# EasyEDA schematic SCH_PicoPocket_2025-07-21.json
TITLE: PICOPOCKET; REV: 1.0; Date: 2024-08-20; Sheet: 1/1; Drawn By: Mzoid; Company: Megazoid's Hut
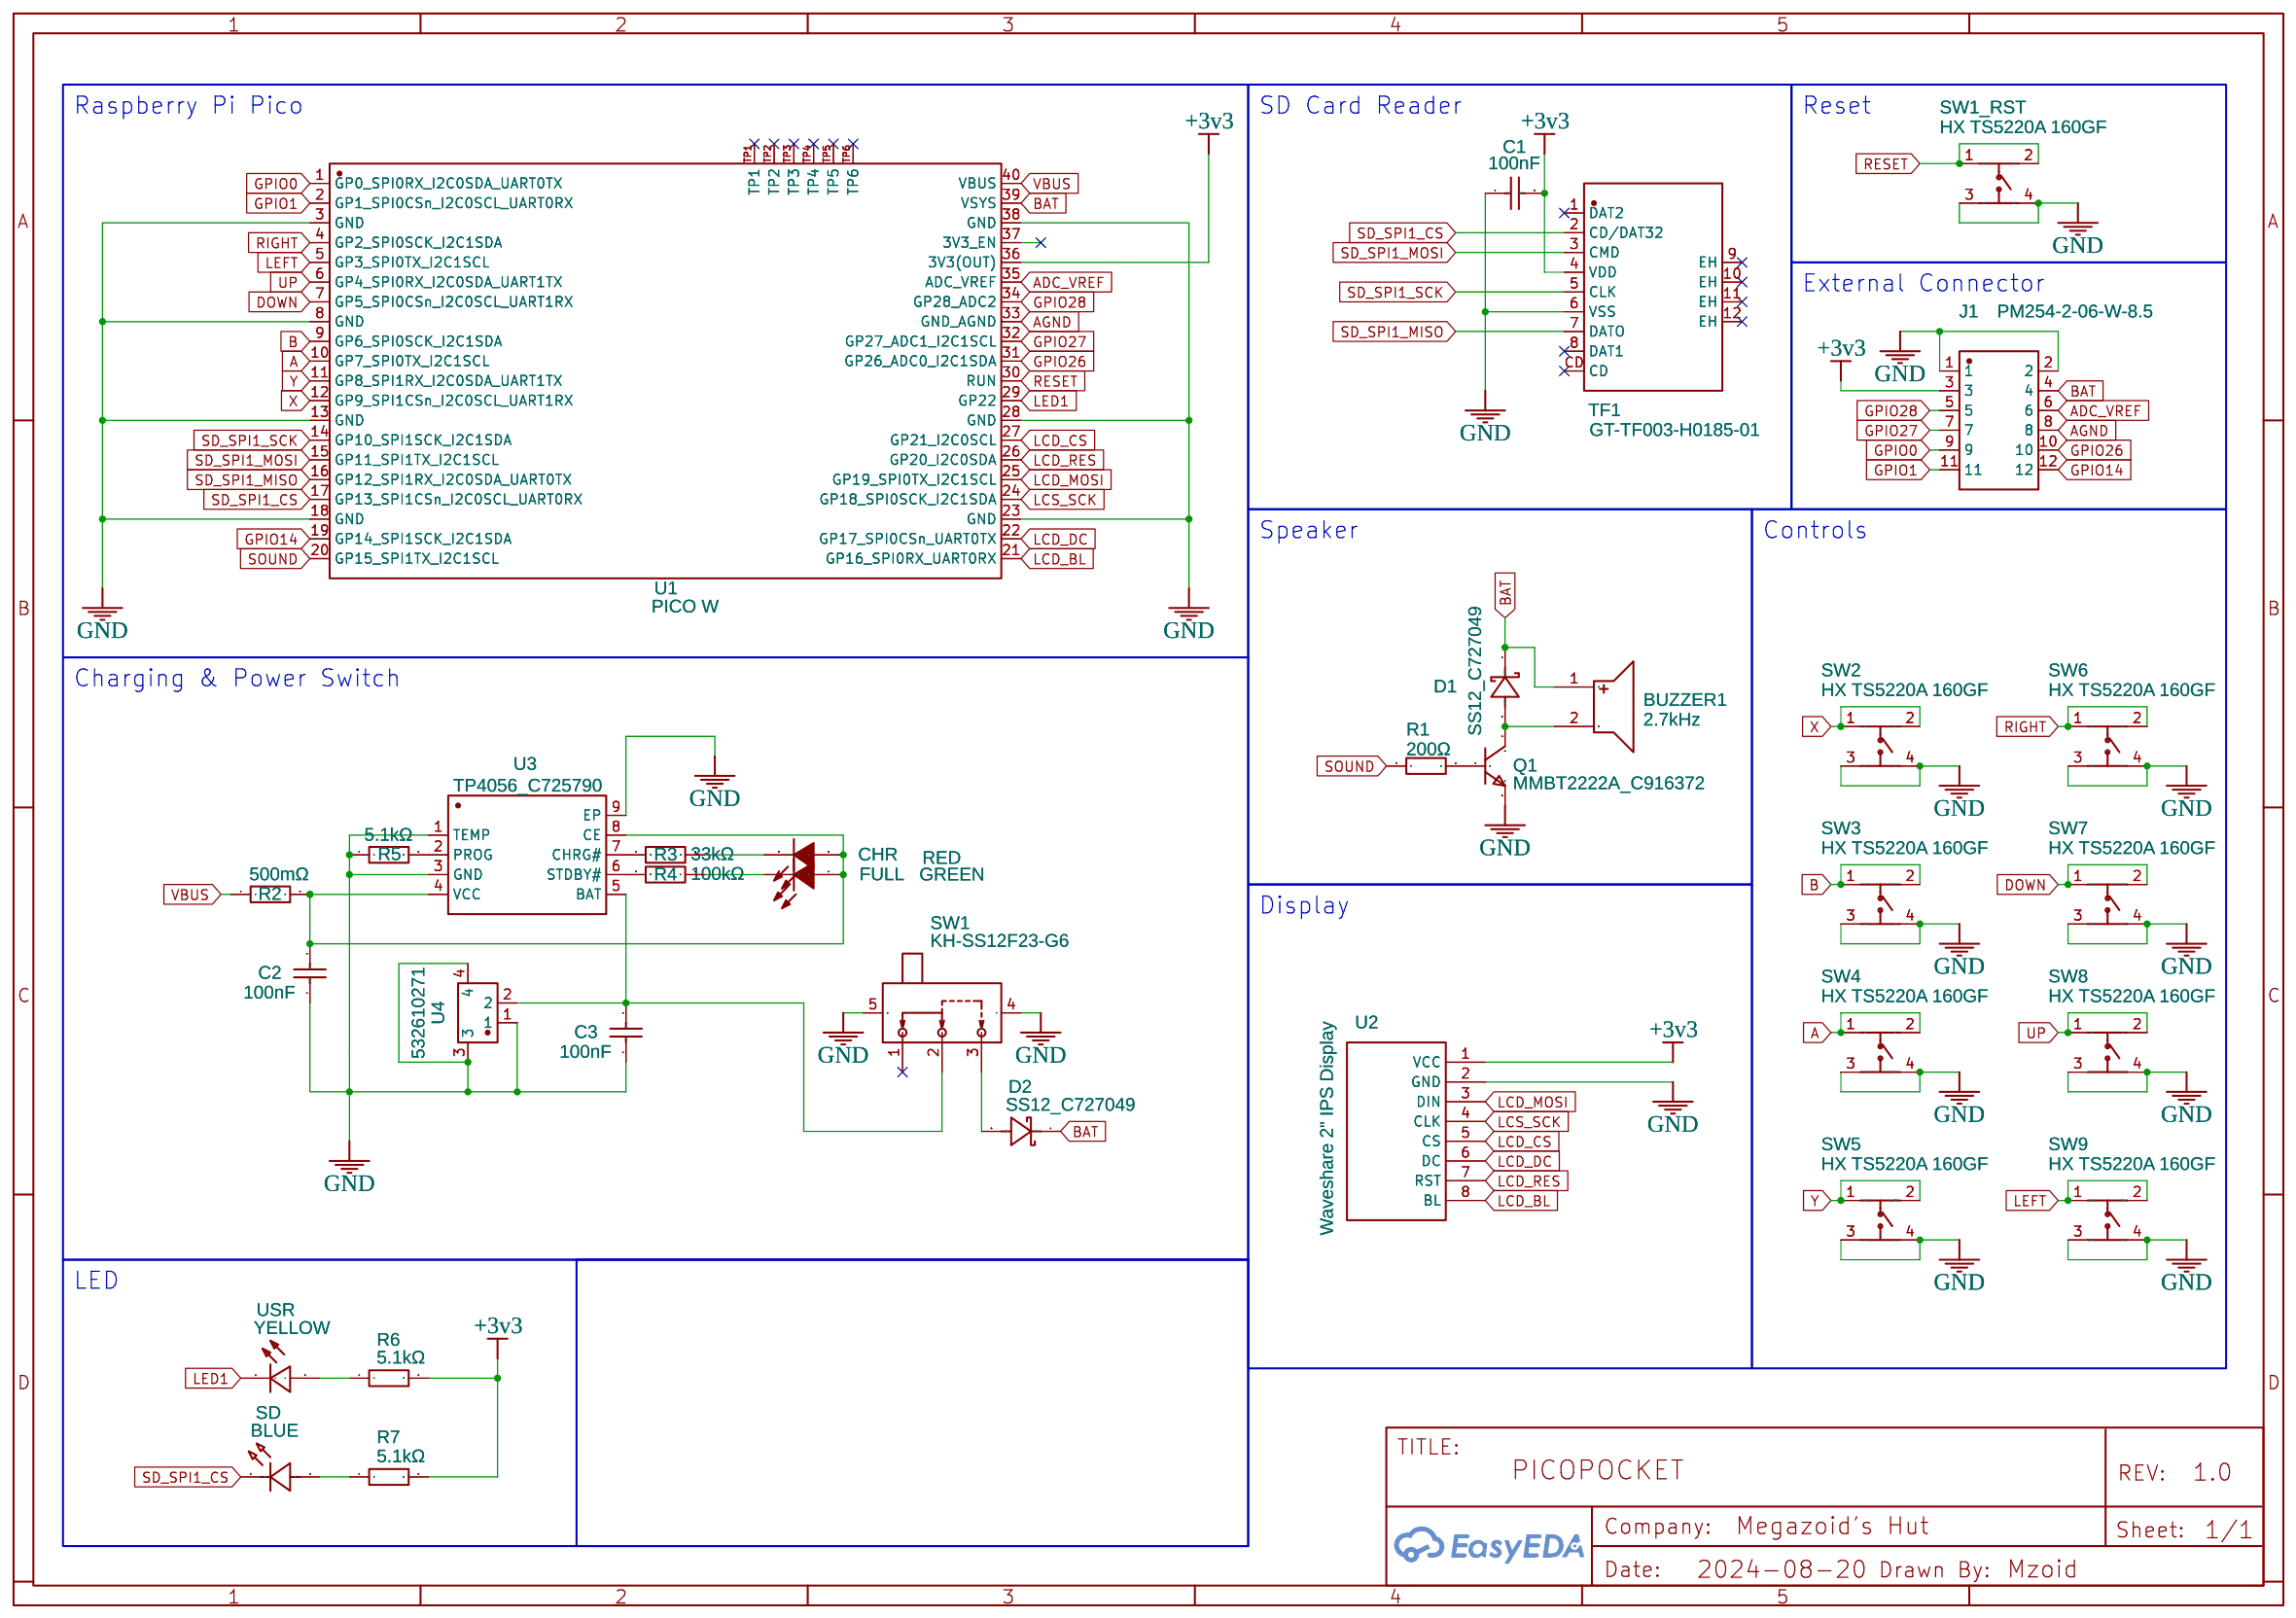
[diagram p0: schematic sheet]

## Parts
BUZZER1  2.7kHz  [BUZ-SMD_FUET-9032-XXV]
C1  100nF  [C0805]
C2  100nF  [C0805]
C3  100nF  [C0805]
CHR  RED  [LED-0603]
D1  SS12_C727049  [SMA_L4.3-W2.5-LS5.0-RD]
D2  SS12_C727049  [SMA_L4.3-W2.5-LS5.0-RD]
FULL  GREEN  [LED-0603]
J1  PM254-2-06-W-8.5  [HDR-TH_12P-P2.54-H-F-R2-C6-W8.5]
Q1  MMBT2222A_C916372  [SOT-23-3_L2.9-W1.3-P1.90-LS2.4-BR]
R1  200Ω  [R0805]
R2  500mΩ  [R0805]
R3  33kΩ  [R0603]
R4  100kΩ  [R0603]
R5  5.1kΩ  [R0603]
R6  5.1kΩ  [R0603]
R7  5.1kΩ  [R0603]
SD  BLUE  [LED0603-RD COPY]
SW1  KH-SS12F23-G6  [SW-TH_KH-SS12F23-G6]
SW1_RST  HX TS5220A 160GF  [SW-SMD_4P-L5.2-W5.2-P3.70-LS6.4]
SW2  HX TS5220A 160GF  [SW-SMD_4P-L5.2-W5.2-P3.70-LS6.4]
SW3  HX TS5220A 160GF  [SW-SMD_4P-L5.2-W5.2-P3.70-LS6.4]
SW4  HX TS5220A 160GF  [SW-SMD_4P-L5.2-W5.2-P3.70-LS6.4]
SW5  HX TS5220A 160GF  [SW-SMD_4P-L5.2-W5.2-P3.70-LS6.4]
SW6  HX TS5220A 160GF  [SW-SMD_4P-L5.2-W5.2-P3.70-LS6.4]
SW7  HX TS5220A 160GF  [SW-SMD_4P-L5.2-W5.2-P3.70-LS6.4]
SW8  HX TS5220A 160GF  [SW-SMD_4P-L5.2-W5.2-P3.70-LS6.4]
SW9  HX TS5220A 160GF  [SW-SMD_4P-L5.2-W5.2-P3.70-LS6.4]
TF1  GT-TF003-H0185-01  [TF-SMD_GT-TF003-H0185-01]
U1  PICO W  [COMM-SMD_L51.0-W21.0-P2.54_PICOW]
U2  Waveshare 2" IPS Display  [2INCH IPS LCD MODULE WAVESHARE NO HOLE]
U3  TP4056_C725790  [ESOP-8_L4.9-W3.9-P1.27-LS6.0-BL-EP]
U4  532610271  [CONN-SMD_532610271]
USR  YELLOW  [LED0603-RD COPY]

## Library data of the parts
BUZZER1 = FUET-9032-05: Contributor: LCSC; Supplier: LCSC; Supplier Part: C2690510; Manufacturer: FUET(福声科技); JLCPCB Part Class: Extended Part
C1-C3 = CC0805KRX7R9BB104: Supplier: LCSC; Manufacturer: YAGEO(国巨); Supplier Part: C49678; JLCPCB Part Class: Basic Part
CHR = -: Supplier: LCSC; Manufacturer: LITEON; Manufacturer Part: LTST-C191KRKT; Contributor: LCSC; Supplier Part: C125099
D1 D2 = SS12_C727049: Contributor: LCSC; Supplier: LCSC; Supplier Part: C727049; Manufacturer: TWGMC(台湾迪嘉); Manufacturer Part: SS12; JLCPCB Part Class: Extended Part
FULL = -: Supplier: LCSC; Manufacturer: LITEON; Manufacturer Part: LTST-C193TGKT-5A; Supplier Part: C12065
J1 = PM254-2-06-W-8.5: Contributor: LCSC; Supplier: LCSC; Supplier Part: C2897426; Manufacturer: HCTL(华灿天禄); JLCPCB Part Class: Extended Part
Q1 = MMBT2222A_C916372: Contributor: LCSC; Supplier: LCSC; Supplier Part: C916372; Manufacturer: JSMSEMI(杰盛微); Manufacturer Part: MMBT2222A; JLCPCB Part Class: Extended Part
R1 = 0805W8F2000T5E: Supplier: LCSC; Manufacturer: UNI-ROYAL(厚声); Supplier Part: C17540; JLCPCB Part Class: Basic Part
R2 = 0805W8F500LT5E: Supplier: LCSC; Manufacturer: UNI-ROYAL(厚声); Supplier Part: C28319; JLCPCB Part Class: Extended Part
R3 = 0603WAF1201T5E: Supplier: LCSC; Manufacturer: UNI-ROYAL(厚声); Supplier Part: C22765; JLCPCB Part Class: Basic Part
R4-R7 = 0603WAF5101T5E: Supplier: LCSC; Manufacturer: UNI-ROYAL(厚声); Supplier Part: C23186; JLCPCB Part Class: Basic Part
SD = LTST-C194TBKT: Contributor: LCSC; Supplier: LCSC; Supplier Part: C575417; Manufacturer: LITEON(光宝); JLCPCB Part Class: Extended Part
SW1 = KH-SS12F23-G6: Contributor: lcsc; Supplier: LCSC; Supplier Part: C5274466; Manufacturer: kinghelm(金航标); JLCPCB Part Class: Extended Part
SW1_RST SW2-SW9 = HX TS5220A 160GF: Contributor: lcsc; Supplier: LCSC; Supplier Part: C5340185; Manufacturer: hanxia(韩下); Manufacturer Part: HX TS5220A 160gf; JLCPCB Part Class: Extended Part
TF1 = GT-TF003-H0185-01: Supplier: LCSC; Supplier Part: C5155563; Manufacturer: G-Switch(品赞); JLCPCB Part Class: Extended Part; Contributor: lcsc
U1 = PICO W: Supplier: LCSC; Supplier Part: C7203003; Manufacturer: Raspberry Pi(树莓派); Contributor: lcsc; JLCPCB Part Class: Extended Part
U2 = WAVESHARE 2INCH IPS LCD MODULE: Manufacturer: Waveshare; Manufacturer Part: 2inch LCD Module; Contributor: Tong He (ht93); subpart_no: 1; link: https://www.waveshare.com/wiki/2inch_LCD_Module; Package Display: No
U3 = TP4056_C725790: Contributor: LCSC; Supplier: LCSC; Supplier Part: C725790; Manufacturer: UMW(友台半导体); Manufacturer Part: TP4056; JLCPCB Part Class: Extended Part
U4 = 532610271_C177225: Supplier: LCSC; Supplier Part: C177225; Manufacturer: MOLEX; JLCPCB Part Class: Extended Part; Contributor: lcsc
USR = LTST-C190GKT: Contributor: LCSC; Supplier: LCSC; Supplier Part: C125093; Manufacturer: LITEON(光宝); JLCPCB Part Class: Extended Part

## Nets
+3v3: C1.2 J1.3 R6.2 R7.2 TF1.4(VDD) U1.36(3V3(OUT)) U2.1(VCC)
AGND: J1.8 U1.33(GND_AGND)
GND: C1.1 C2.1 C3.1 J1.1 J1.2 Q1.2(E) R5.1 SW1.4 SW1.5 SW1_RST.3 SW1_RST.4 SW2.3 SW2.4 SW3.3 SW3.4 SW4.3 SW4.4 SW5.3 SW5.4 SW6.3 SW6.4 SW7.3 SW7.4 SW8.3 SW8.4 SW9.3 SW9.4 TF1.6(VSS) U1.3(GND) U1.8(GND) U1.13(GND) U1.18(GND) U1.23(GND) U1.28(GND) U1.38(GND) U2.2(GND) U3.1(TEMP) U3.3(GND) U3.9(EP) U4.1 U4.3 U4.4
VBUS: R2.1 U1.40(VBUS)
A: SW4.1 SW4.2 U1.10(GP7_SPI0TX_I2C1SCL)
ADC_VREF: J1.6 U1.35(ADC_VREF)
B: SW3.1 SW3.2 U1.9(GP6_SPI0SCK_I2C1SDA)
BAT: BUZZER1.1 D1.1 D2.1 J1.4 U1.39(VSYS)
DOWN: SW7.1 SW7.2 U1.7(GP5_SPI0CSn_I2C0SCL_UART1RX)
GPIO0: J1.9 U1.1(GP0_SPI0RX_I2C0SDA_UART0TX)
GPIO1: J1.11 U1.2(GP1_SPI0CSn_I2C0SCL_UART0RX)
GPIO14: J1.12 U1.19(GP14_SPI1SCK_I2C1SDA)
GPIO26: J1.10 U1.31(GP26_ADC0_I2C1SDA)
GPIO27: J1.7 U1.32(GP27_ADC1_I2C1SCL)
GPIO28: J1.5 U1.34(GP28_ADC2)
LCD_BL: U1.21(GP16_SPI0RX_UART0RX) U2.8(BL)
LCD_CS: U1.27(GP21_I2C0SCL) U2.5(CS)
LCD_DC: U1.22(GP17_SPI0CSn_UART0TX) U2.6(DC)
LCD_MOSI: U1.25(GP19_SPI0TX_I2C1SCL) U2.3(DIN)
LCD_RES: U1.26(GP20_I2C0SDA) U2.7(RST)
LCS_SCK: U1.24(GP18_SPI0SCK_I2C1SDA) U2.4(CLK)
LED1: U1.29(GP22) USR.1(-)
LEFT: SW9.1 SW9.2 U1.5(GP3_SPI0TX_I2C1SCL)
RESET: SW1_RST.1 SW1_RST.2 U1.30(RUN)
RIGHT: SW6.1 SW6.2 U1.4(GP2_SPI0SCK_I2C1SDA)
SD_SPI1_CS: SD.1(K) TF1.2(CD/DAT32) U1.17(GP13_SPI1CSn_I2C0SCL_UART0RX)
SD_SPI1_MISO: TF1.7(DATO) U1.16(GP12_SPI1RX_I2C0SDA_UART0TX)
SD_SPI1_MOSI: TF1.3(CMD) U1.15(GP11_SPI1TX_I2C1SCL)
SD_SPI1_SCK: TF1.5(CLK) U1.14(GP10_SPI1SCK_I2C1SDA)
SOUND: R1.1 U1.20(GP15_SPI1TX_I2C1SCL)
UP: SW8.1 SW8.2 U1.6(GP4_SPI0RX_I2C0SDA_UART1TX)
X: SW2.1 SW2.2 U1.12(GP9_SPI1CSn_I2C0SCL_UART1RX)
Y: SW5.1 SW5.2 U1.11(GP8_SPI1RX_I2C0SDA_UART1TX)
Net-(BUZZER1-2): BUZZER1.2 D1.2 Q1.3(C)
Net-(C2-2): C2.2 CHR.1(A) FULL.1(A) R2.2 U3.4(VCC) U3.8(CE)
Net-(C3-2): C3.2 SW1.2 U3.5(BAT) U4.2
Net-(CHR-2): CHR.2(K) R3.2
Net-(D2-2): D2.2 SW1.3
Net-(FULL-2): FULL.2(K) R4.1
Net-(Q1-1): Q1.1(B) R1.2
Net-(R3-1): R3.1 U3.7(CHRG#)
Net-(R4-2): R4.2 U3.6(STDBY#)
Net-(R5-2): R5.2 U3.2(PROG)
Net-(R6-1): R6.1 USR.2(+)
Net-(R7-1): R7.1 SD.2(A)

Not connected (* = marked no-connect by the designer): SW1 1*; TF1 1(DAT2)* 8(DAT1)* 9(EH)* 10(EH)* 11(EH)* 12(EH)* CD*; U1 37(3V3_EN) TP1* TP2* TP3* TP4* TP5* TP6*

## Notes on the sheet
- Raspberry Pi Pico
- SD Card Reader
- Reset
- External Connector
- Speaker
- Controls
- Charging & Power Switch
- Display
- LED
